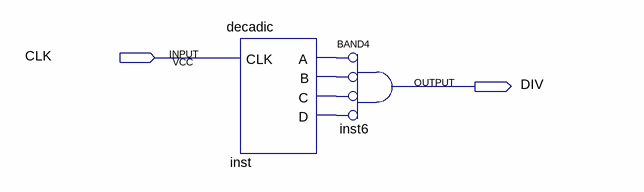
[diagram p0: schematic sheet]
// Quartus schematic decadic_div.bdf as structural Verilog: 2 symbols, 2 pins
module decadic_div (
  input  CLK,
  output DIV
);

  wire inst_a, inst_b, inst_c, inst_d;

  decadic inst (.CLK(CLK), .A(inst_a), .B(inst_b), .C(inst_c), .D(inst_d));
  and inst6 (DIV, ~inst_a, ~inst_b, ~inst_c, ~inst_d);  // BAND4
endmodule
